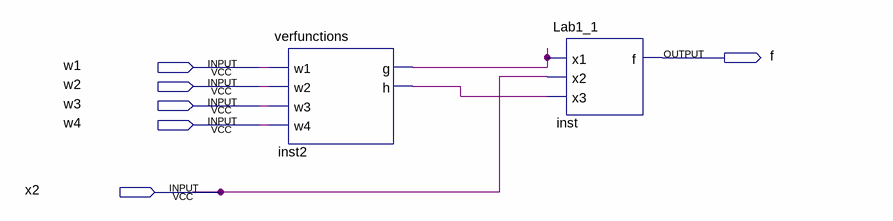
[diagram p0: schematic sheet]
// Quartus schematic Block4.bdf as structural Verilog: 2 symbols, 6 pins
module Block4 (
  input  w1,
  input  w2,
  input  w3,
  input  w4,
  input  x2,
  output f
);

  wire inst2_g, inst2_h;

  verfunctions inst2 (.w1(w1), .w2(w2), .w3(w3), .w4(w4), .g(inst2_g), .h(inst2_h));
  Lab1_1 inst (.x1(inst2_g), .x2(x2), .x3(inst2_h), .f(f));
endmodule
